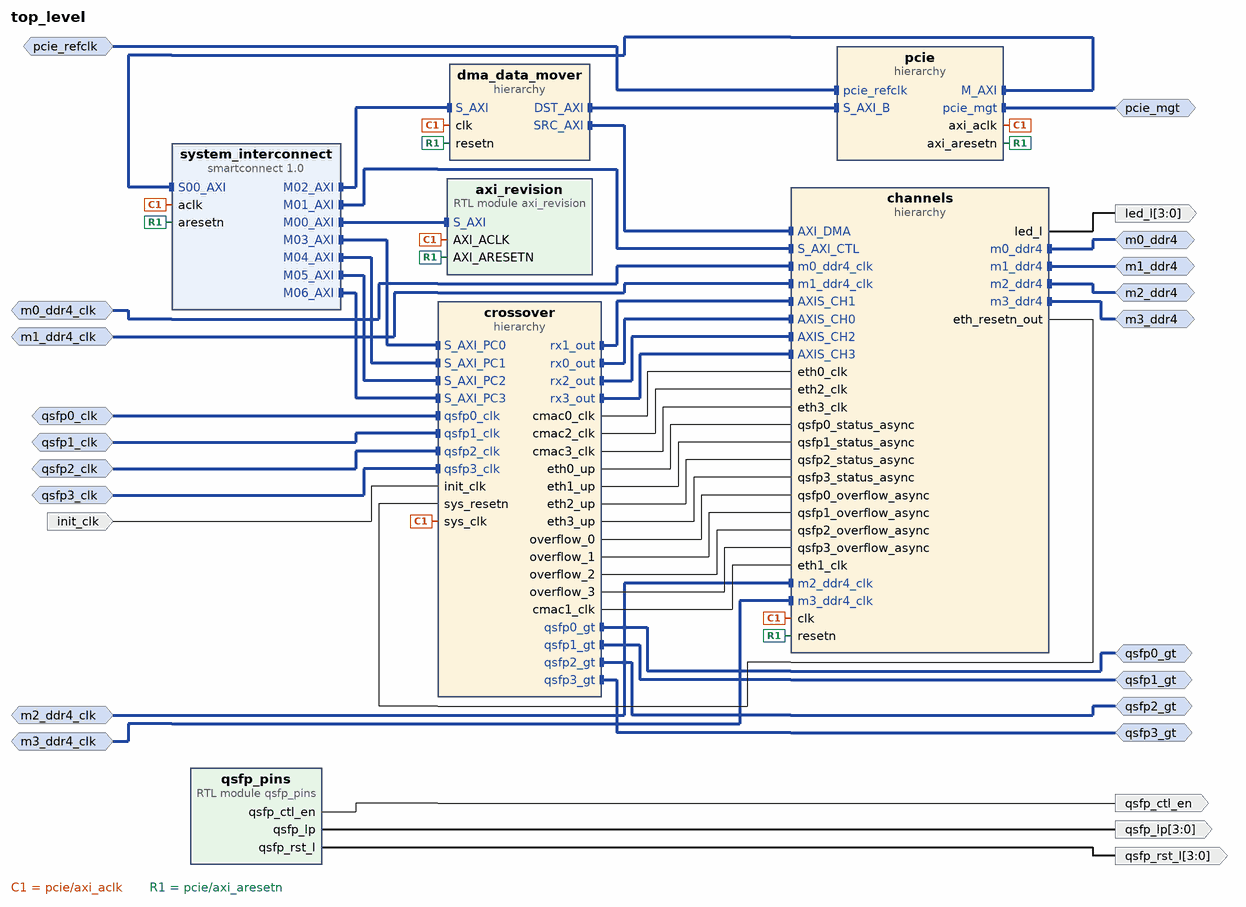
[diagram p0: block diagram of the top level]
# Vivado block design top_level, xcvu9p-flgb2104-3-e, Vivado 2021.1
create_bd_design top_level

create_bd_intf_port -mode Slave -vlnv xilinx.com:interface:diff_clock_rtl:1.0 qsfp0_clk
set_property -dict {CONFIG.FREQ_HZ 322265625} [get_bd_intf_ports qsfp0_clk]
create_bd_intf_port -mode Master -vlnv xilinx.com:interface:gt_rtl:1.0 qsfp0_gt
create_bd_intf_port -mode Master -vlnv xilinx.com:interface:gt_rtl:1.0 qsfp1_gt
create_bd_intf_port -mode Slave -vlnv xilinx.com:interface:diff_clock_rtl:1.0 qsfp1_clk
set_property -dict {CONFIG.FREQ_HZ 322265625} [get_bd_intf_ports qsfp1_clk]
create_bd_intf_port -mode Slave -vlnv xilinx.com:interface:diff_clock_rtl:1.0 pcie_refclk
create_bd_intf_port -mode Master -vlnv xilinx.com:interface:pcie_7x_mgt_rtl:1.0 pcie_mgt
create_bd_intf_port -mode Master -vlnv xilinx.com:interface:gt_rtl:1.0 qsfp2_gt
create_bd_intf_port -mode Slave -vlnv xilinx.com:interface:diff_clock_rtl:1.0 qsfp2_clk
set_property -dict {CONFIG.FREQ_HZ 322265625} [get_bd_intf_ports qsfp2_clk]
create_bd_intf_port -mode Master -vlnv xilinx.com:interface:gt_rtl:1.0 qsfp3_gt
create_bd_intf_port -mode Slave -vlnv xilinx.com:interface:diff_clock_rtl:1.0 qsfp3_clk
set_property -dict {CONFIG.FREQ_HZ 322265625} [get_bd_intf_ports qsfp3_clk]
create_bd_intf_port -mode Master -vlnv xilinx.com:interface:ddr4_rtl:1.0 m0_ddr4
create_bd_intf_port -mode Slave -vlnv xilinx.com:interface:diff_clock_rtl:1.0 m0_ddr4_clk
create_bd_intf_port -mode Master -vlnv xilinx.com:interface:ddr4_rtl:1.0 m1_ddr4
create_bd_intf_port -mode Slave -vlnv xilinx.com:interface:diff_clock_rtl:1.0 m1_ddr4_clk
create_bd_intf_port -mode Slave -vlnv xilinx.com:interface:diff_clock_rtl:1.0 m2_ddr4_clk
create_bd_intf_port -mode Master -vlnv xilinx.com:interface:ddr4_rtl:1.0 m2_ddr4
create_bd_intf_port -mode Master -vlnv xilinx.com:interface:ddr4_rtl:1.0 m3_ddr4
create_bd_intf_port -mode Slave -vlnv xilinx.com:interface:diff_clock_rtl:1.0 m3_ddr4_clk
create_bd_port -dir O -from 3 -to 0 qsfp_rst_l
create_bd_port -dir O -from 3 -to 0 qsfp_lp
create_bd_port -dir I init_clk
create_bd_port -dir O qsfp_ctl_en
create_bd_port -dir O -from 3 -to 0 led_l

create_bd_cell -type hier crossover
create_bd_cell -type hier pcie
create_bd_cell -type module -reference qsfp_pins qsfp_pins
create_bd_cell -type hier channels
create_bd_cell -type ip -vlnv xilinx.com:ip:smartconnect:1.0 system_interconnect
set_property -dict {CONFIG.NUM_MI 7 CONFIG.NUM_SI 1} [get_bd_cells system_interconnect]
create_bd_cell -type hier dma_data_mover
create_bd_cell -type module -reference axi_revision axi_revision
set_property -dict {CONFIG.S_AXI_ADDR_WIDTH 5} [get_bd_cells axi_revision]

# ---- hierarchy /crossover ----
current_bd_instance /crossover
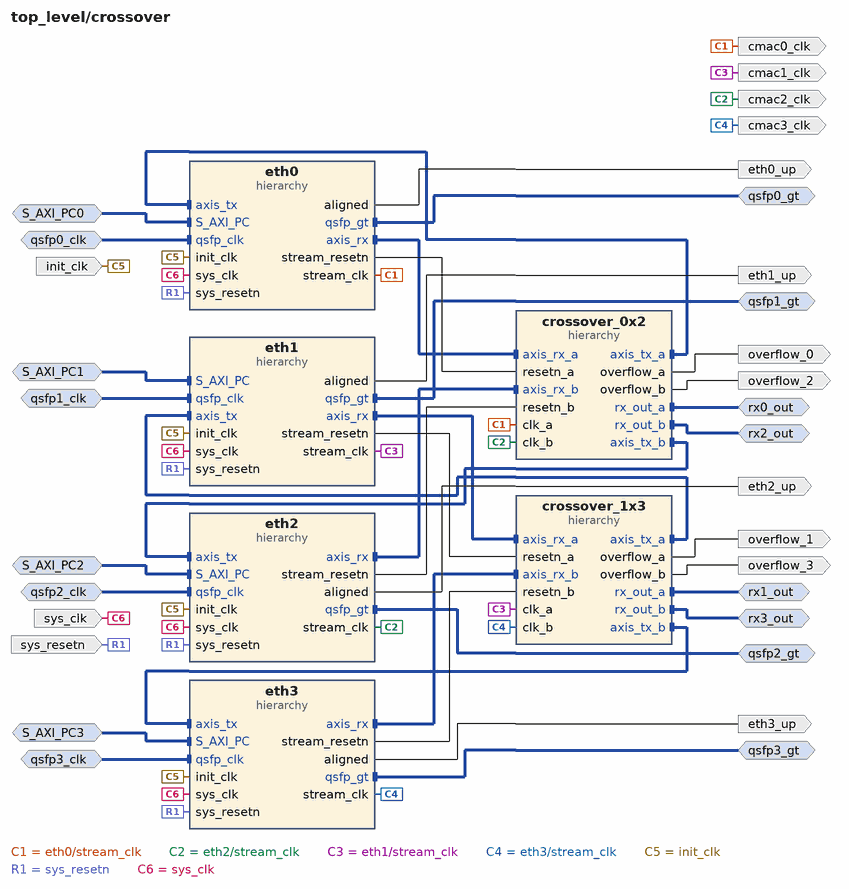
[diagram p1: block diagram inside /crossover]
create_bd_intf_pin -mode Master -vlnv xilinx.com:interface:gt_rtl:1.0 qsfp0_gt
create_bd_intf_pin -mode Slave -vlnv xilinx.com:interface:diff_clock_rtl:1.0 qsfp0_clk
create_bd_intf_pin -mode Master -vlnv xilinx.com:interface:gt_rtl:1.0 qsfp1_gt
create_bd_intf_pin -mode Slave -vlnv xilinx.com:interface:diff_clock_rtl:1.0 qsfp1_clk
create_bd_intf_pin -mode Master -vlnv xilinx.com:interface:gt_rtl:1.0 qsfp2_gt
create_bd_intf_pin -mode Slave -vlnv xilinx.com:interface:diff_clock_rtl:1.0 qsfp2_clk
create_bd_intf_pin -mode Master -vlnv xilinx.com:interface:gt_rtl:1.0 qsfp3_gt
create_bd_intf_pin -mode Slave -vlnv xilinx.com:interface:diff_clock_rtl:1.0 qsfp3_clk
create_bd_intf_pin -mode Master -vlnv xilinx.com:interface:axis_rtl:1.0 rx0_out
create_bd_intf_pin -mode Master -vlnv xilinx.com:interface:axis_rtl:1.0 rx2_out
create_bd_intf_pin -mode Master -vlnv xilinx.com:interface:axis_rtl:1.0 rx1_out
create_bd_intf_pin -mode Master -vlnv xilinx.com:interface:axis_rtl:1.0 rx3_out
create_bd_intf_pin -mode Slave -vlnv xilinx.com:interface:aximm_rtl:1.0 S_AXI_PC0
create_bd_intf_pin -mode Slave -vlnv xilinx.com:interface:aximm_rtl:1.0 S_AXI_PC2
create_bd_intf_pin -mode Slave -vlnv xilinx.com:interface:aximm_rtl:1.0 S_AXI_PC1
create_bd_intf_pin -mode Slave -vlnv xilinx.com:interface:aximm_rtl:1.0 S_AXI_PC3
create_bd_pin -dir I init_clk
create_bd_pin -dir I sys_resetn
create_bd_pin -dir O overflow_0
create_bd_pin -dir O overflow_2
create_bd_pin -dir O overflow_1
create_bd_pin -dir O overflow_3
create_bd_pin -dir O cmac2_clk
create_bd_pin -dir O cmac0_clk
create_bd_pin -dir O cmac1_clk
create_bd_pin -dir O cmac3_clk
create_bd_pin -dir O eth2_up
create_bd_pin -dir O eth1_up
create_bd_pin -dir O eth3_up
create_bd_pin -dir O eth0_up
create_bd_pin -dir I sys_clk

create_bd_cell -type hier crossover_0x2
create_bd_cell -type hier eth0
create_bd_cell -type hier eth2
create_bd_cell -type hier eth1
create_bd_cell -type hier eth3
create_bd_cell -type hier crossover_1x3

# ---- hierarchy /crossover/crossover_0x2 ----
current_bd_instance /crossover/crossover_0x2
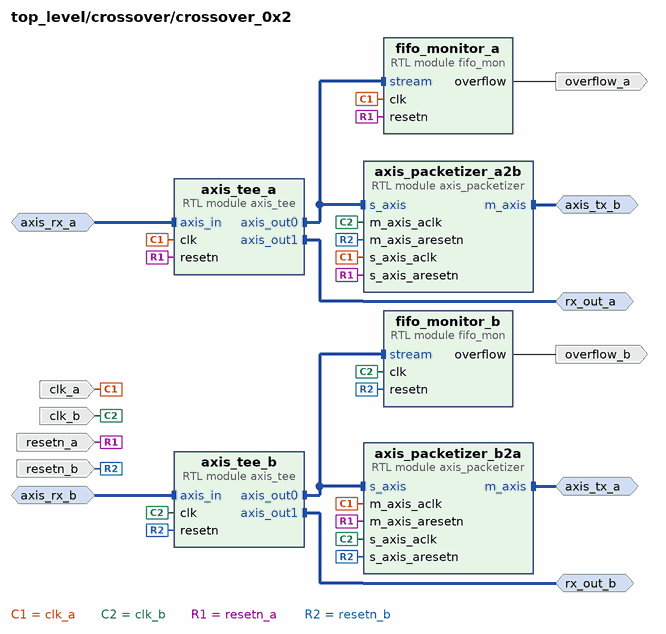
[diagram p2: block diagram inside /crossover/crossover_0x2]
create_bd_intf_pin -mode Slave -vlnv xilinx.com:interface:axis_rtl:1.0 axis_rx_a
create_bd_intf_pin -mode Master -vlnv xilinx.com:interface:axis_rtl:1.0 axis_tx_b
create_bd_intf_pin -mode Master -vlnv xilinx.com:interface:axis_rtl:1.0 axis_tx_a
create_bd_intf_pin -mode Slave -vlnv xilinx.com:interface:axis_rtl:1.0 axis_rx_b
create_bd_intf_pin -mode Master -vlnv xilinx.com:interface:axis_rtl:1.0 rx_out_a
create_bd_intf_pin -mode Master -vlnv xilinx.com:interface:axis_rtl:1.0 rx_out_b
create_bd_pin -dir I clk_a
create_bd_pin -dir I resetn_a
create_bd_pin -dir I clk_b
create_bd_pin -dir I resetn_b
create_bd_pin -dir O overflow_a
create_bd_pin -dir O overflow_b

create_bd_cell -type module -reference axis_tee axis_tee_a
create_bd_cell -type module -reference axis_tee axis_tee_b
create_bd_cell -type module -reference fifo_mon fifo_monitor_a
create_bd_cell -type module -reference fifo_mon fifo_monitor_b
create_bd_cell -type module -reference axis_packetizer axis_packetizer_a2b
create_bd_cell -type module -reference axis_packetizer axis_packetizer_b2a

# ---- hierarchy /crossover/eth0 ----
current_bd_instance /crossover/eth0
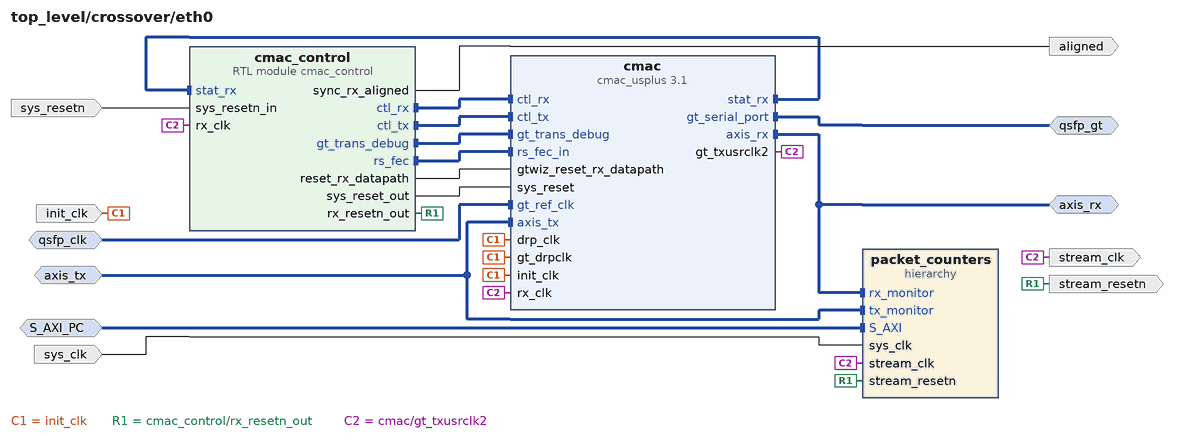
[diagram p3: block diagram inside /crossover/eth0]
create_bd_intf_pin -mode Master -vlnv xilinx.com:interface:gt_rtl:1.0 qsfp_gt
create_bd_intf_pin -mode Slave -vlnv xilinx.com:interface:diff_clock_rtl:1.0 qsfp_clk
create_bd_intf_pin -mode Slave -vlnv xilinx.com:interface:axis_rtl:1.0 axis_tx
create_bd_intf_pin -mode Master -vlnv xilinx.com:interface:axis_rtl:1.0 axis_rx
create_bd_intf_pin -mode Slave -vlnv xilinx.com:interface:aximm_rtl:1.0 S_AXI_PC
create_bd_pin -dir I -type rst sys_resetn
create_bd_pin -dir O -type clk stream_clk
create_bd_pin -dir O -type rst stream_resetn
create_bd_pin -dir O aligned
create_bd_pin -dir I init_clk
create_bd_pin -dir I sys_clk

create_bd_cell -type ip -vlnv xilinx.com:ip:cmac_usplus:3.1 cmac
set_property -dict [list \
  CONFIG.ADD_GT_CNRL_STS_PORTS 1 \
  CONFIG.CMAC_CAUI4_MODE 1 \
  CONFIG.CMAC_CORE_SELECT CMACE4_X0Y1 \
  CONFIG.GT_DRP_CLK 50 \
  CONFIG.GT_GROUP_SELECT {X0Y4~X0Y7} \
  CONFIG.GT_REF_CLK_FREQ 322.265625 \
  CONFIG.INCLUDE_RS_FEC 1 \
  CONFIG.NUM_LANES 4x25 \
  CONFIG.RX_FLOW_CONTROL 0 \
  CONFIG.RX_GT_BUFFER 1 \
  CONFIG.TX_FLOW_CONTROL 0 \
  CONFIG.USER_INTERFACE AXIS \
] [get_bd_cells cmac]
create_bd_cell -type module -reference cmac_control cmac_control
set_property -dict {CONFIG.USE_SYS_RESET_OUT 1} [get_bd_cells cmac_control]
create_bd_cell -type hier packet_counters

# ---- hierarchy /crossover/eth0/packet_counters ----
current_bd_instance /crossover/eth0/packet_counters
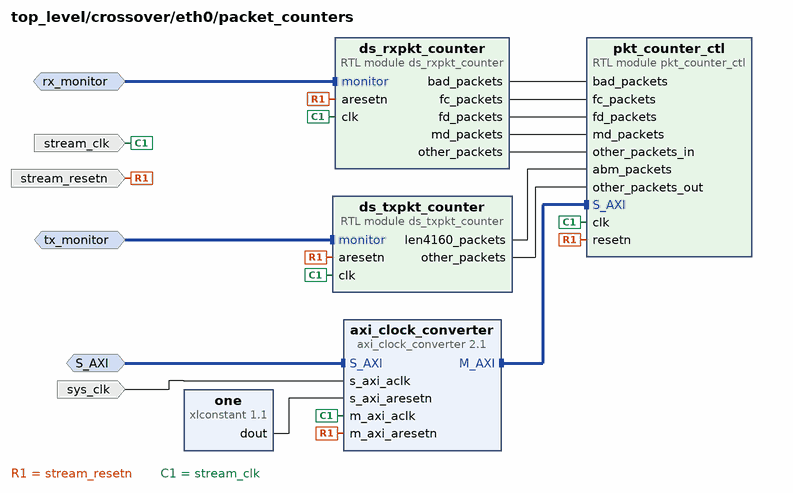
[diagram p4: block diagram inside /crossover/eth0/packet_counters]
create_bd_intf_pin -mode Monitor -vlnv xilinx.com:interface:axis_rtl:1.0 tx_monitor
create_bd_intf_pin -mode Monitor -vlnv xilinx.com:interface:axis_rtl:1.0 rx_monitor
create_bd_intf_pin -mode Slave -vlnv xilinx.com:interface:aximm_rtl:1.0 S_AXI
create_bd_pin -dir I -type clk stream_clk
create_bd_pin -dir I -type rst stream_resetn
create_bd_pin -dir I sys_clk

create_bd_cell -type ip -vlnv xilinx.com:ip:axi_clock_converter:2.1 axi_clock_converter
create_bd_cell -type ip -vlnv xilinx.com:ip:xlconstant:1.1 one
create_bd_cell -type module -reference pkt_counter_ctl pkt_counter_ctl
create_bd_cell -type module -reference ds_rxpkt_counter ds_rxpkt_counter
create_bd_cell -type module -reference ds_txpkt_counter ds_txpkt_counter

# ---- hierarchy /crossover/eth2 ----
current_bd_instance /crossover/eth2
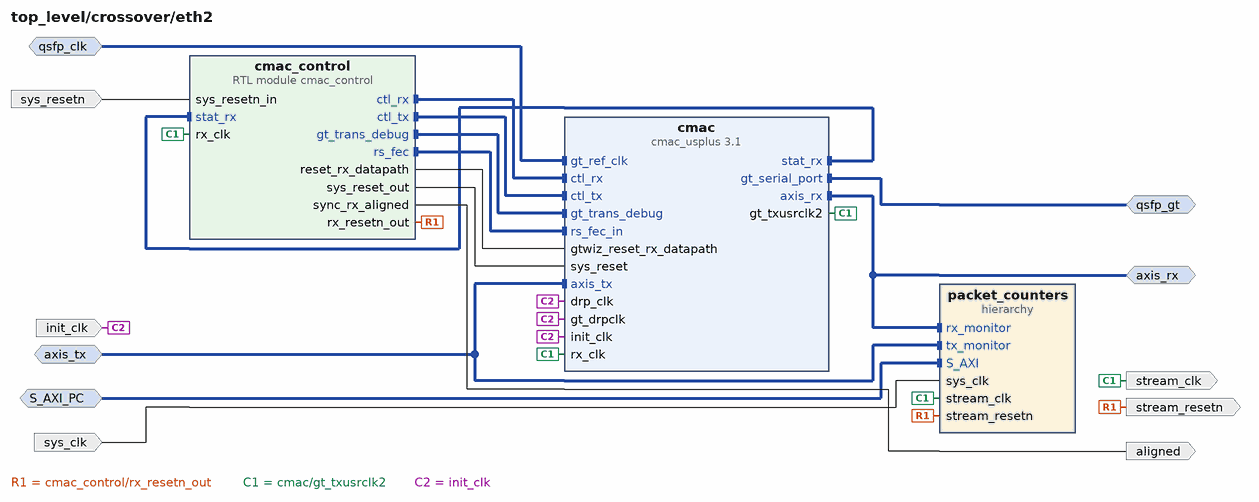
[diagram p5: block diagram inside /crossover/eth2]
create_bd_intf_pin -mode Master -vlnv xilinx.com:interface:gt_rtl:1.0 qsfp_gt
create_bd_intf_pin -mode Slave -vlnv xilinx.com:interface:axis_rtl:1.0 axis_tx
create_bd_intf_pin -mode Master -vlnv xilinx.com:interface:axis_rtl:1.0 axis_rx
create_bd_intf_pin -mode Slave -vlnv xilinx.com:interface:diff_clock_rtl:1.0 qsfp_clk
create_bd_intf_pin -mode Slave -vlnv xilinx.com:interface:aximm_rtl:1.0 S_AXI_PC
create_bd_pin -dir I -type rst sys_resetn
create_bd_pin -dir O -type clk stream_clk
create_bd_pin -dir O -type rst stream_resetn
create_bd_pin -dir O aligned
create_bd_pin -dir I init_clk
create_bd_pin -dir I sys_clk

create_bd_cell -type ip -vlnv xilinx.com:ip:cmac_usplus:3.1 cmac
set_property -dict [list \
  CONFIG.ADD_GT_CNRL_STS_PORTS 1 \
  CONFIG.CMAC_CAUI4_MODE 1 \
  CONFIG.CMAC_CORE_SELECT CMACE4_X0Y4 \
  CONFIG.GT_DRP_CLK 50 \
  CONFIG.GT_GROUP_SELECT {X0Y24~X0Y27} \
  CONFIG.GT_REF_CLK_FREQ 322.265625 \
  CONFIG.INCLUDE_RS_FEC 1 \
  CONFIG.NUM_LANES 4x25 \
  CONFIG.RX_FLOW_CONTROL 0 \
  CONFIG.RX_GT_BUFFER 1 \
  CONFIG.TX_FLOW_CONTROL 0 \
  CONFIG.USER_INTERFACE AXIS \
] [get_bd_cells cmac]
create_bd_cell -type module -reference cmac_control cmac_control
set_property -dict {CONFIG.USE_SYS_RESET_OUT 1} [get_bd_cells cmac_control]
create_bd_cell -type hier packet_counters

# ---- hierarchy /crossover/eth2/packet_counters ----
current_bd_instance /crossover/eth2/packet_counters
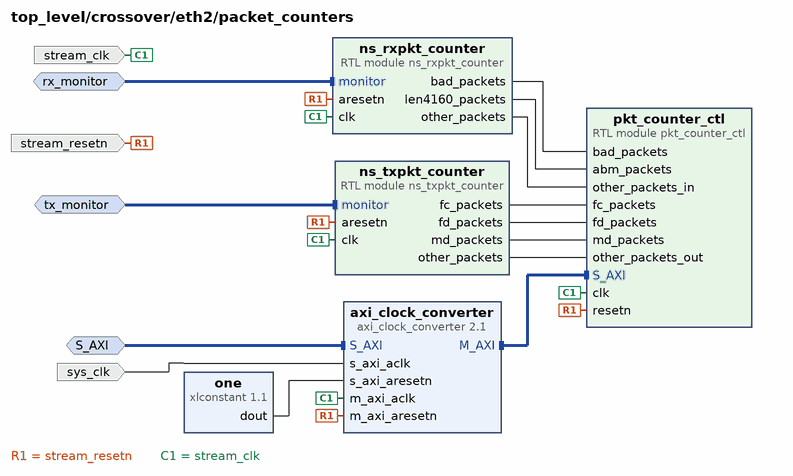
[diagram p6: block diagram inside /crossover/eth2/packet_counters]
create_bd_intf_pin -mode Monitor -vlnv xilinx.com:interface:axis_rtl:1.0 tx_monitor
create_bd_intf_pin -mode Monitor -vlnv xilinx.com:interface:axis_rtl:1.0 rx_monitor
create_bd_intf_pin -mode Slave -vlnv xilinx.com:interface:aximm_rtl:1.0 S_AXI
create_bd_pin -dir I -type clk stream_clk
create_bd_pin -dir I -type rst stream_resetn
create_bd_pin -dir I sys_clk

create_bd_cell -type module -reference ns_txpkt_counter ns_txpkt_counter
create_bd_cell -type module -reference ns_rxpkt_counter ns_rxpkt_counter
create_bd_cell -type ip -vlnv xilinx.com:ip:axi_clock_converter:2.1 axi_clock_converter
create_bd_cell -type ip -vlnv xilinx.com:ip:xlconstant:1.1 one
create_bd_cell -type module -reference pkt_counter_ctl pkt_counter_ctl

# ---- hierarchy /crossover/eth1 ----
current_bd_instance /crossover/eth1
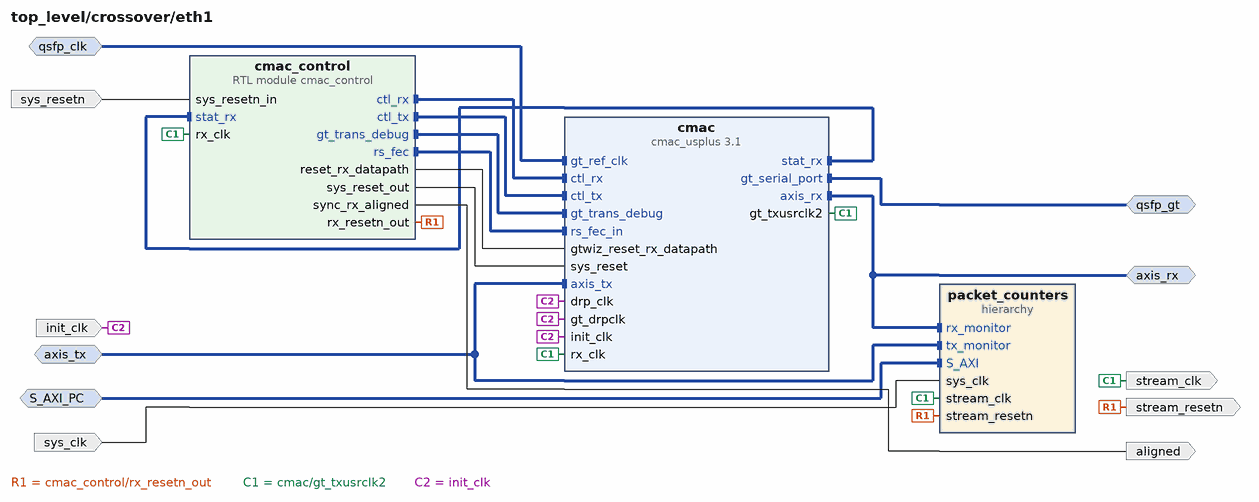
[diagram p7: block diagram inside /crossover/eth1]
create_bd_intf_pin -mode Master -vlnv xilinx.com:interface:gt_rtl:1.0 qsfp_gt
create_bd_intf_pin -mode Slave -vlnv xilinx.com:interface:axis_rtl:1.0 axis_tx
create_bd_intf_pin -mode Master -vlnv xilinx.com:interface:axis_rtl:1.0 axis_rx
create_bd_intf_pin -mode Slave -vlnv xilinx.com:interface:diff_clock_rtl:1.0 qsfp_clk
create_bd_intf_pin -mode Slave -vlnv xilinx.com:interface:aximm_rtl:1.0 S_AXI_PC
create_bd_pin -dir I -type rst sys_resetn
create_bd_pin -dir O -type clk stream_clk
create_bd_pin -dir O -type rst stream_resetn
create_bd_pin -dir O aligned
create_bd_pin -dir I init_clk
create_bd_pin -dir I sys_clk

create_bd_cell -type ip -vlnv xilinx.com:ip:cmac_usplus:3.1 cmac
set_property -dict [list \
  CONFIG.ADD_GT_CNRL_STS_PORTS 1 \
  CONFIG.CMAC_CAUI4_MODE 1 \
  CONFIG.CMAC_CORE_SELECT CMACE4_X0Y2 \
  CONFIG.GT_DRP_CLK 50 \
  CONFIG.GT_GROUP_SELECT {X0Y12~X0Y15} \
  CONFIG.GT_REF_CLK_FREQ 322.265625 \
  CONFIG.INCLUDE_RS_FEC 1 \
  CONFIG.NUM_LANES 4x25 \
  CONFIG.RX_FLOW_CONTROL 0 \
  CONFIG.RX_GT_BUFFER 1 \
  CONFIG.TX_FLOW_CONTROL 0 \
  CONFIG.USER_INTERFACE AXIS \
] [get_bd_cells cmac]
create_bd_cell -type module -reference cmac_control cmac_control
set_property -dict {CONFIG.USE_SYS_RESET_OUT 1} [get_bd_cells cmac_control]
create_bd_cell -type hier packet_counters

# ---- hierarchy /crossover/eth1/packet_counters ----
current_bd_instance /crossover/eth1/packet_counters
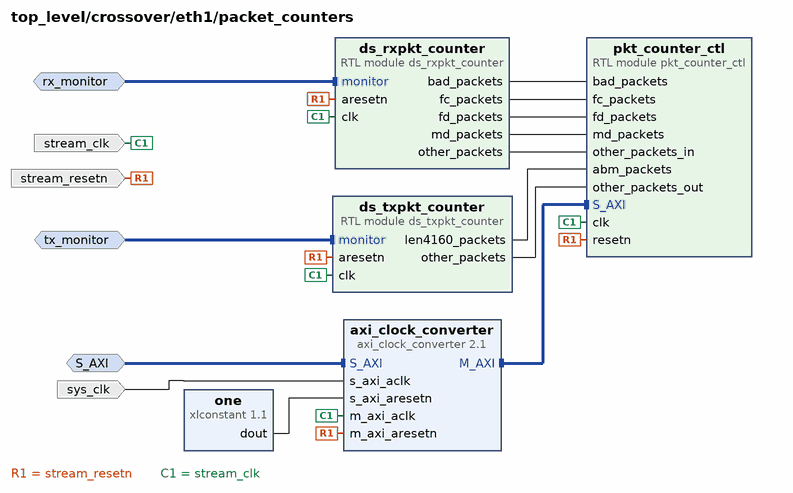
[diagram p8: block diagram inside /crossover/eth1/packet_counters]
create_bd_intf_pin -mode Monitor -vlnv xilinx.com:interface:axis_rtl:1.0 tx_monitor
create_bd_intf_pin -mode Monitor -vlnv xilinx.com:interface:axis_rtl:1.0 rx_monitor
create_bd_intf_pin -mode Slave -vlnv xilinx.com:interface:aximm_rtl:1.0 S_AXI
create_bd_pin -dir I -type clk stream_clk
create_bd_pin -dir I -type rst stream_resetn
create_bd_pin -dir I sys_clk

create_bd_cell -type ip -vlnv xilinx.com:ip:axi_clock_converter:2.1 axi_clock_converter
create_bd_cell -type ip -vlnv xilinx.com:ip:xlconstant:1.1 one
create_bd_cell -type module -reference pkt_counter_ctl pkt_counter_ctl
create_bd_cell -type module -reference ds_rxpkt_counter ds_rxpkt_counter
create_bd_cell -type module -reference ds_txpkt_counter ds_txpkt_counter

# ---- hierarchy /crossover/eth3 ----
current_bd_instance /crossover/eth3
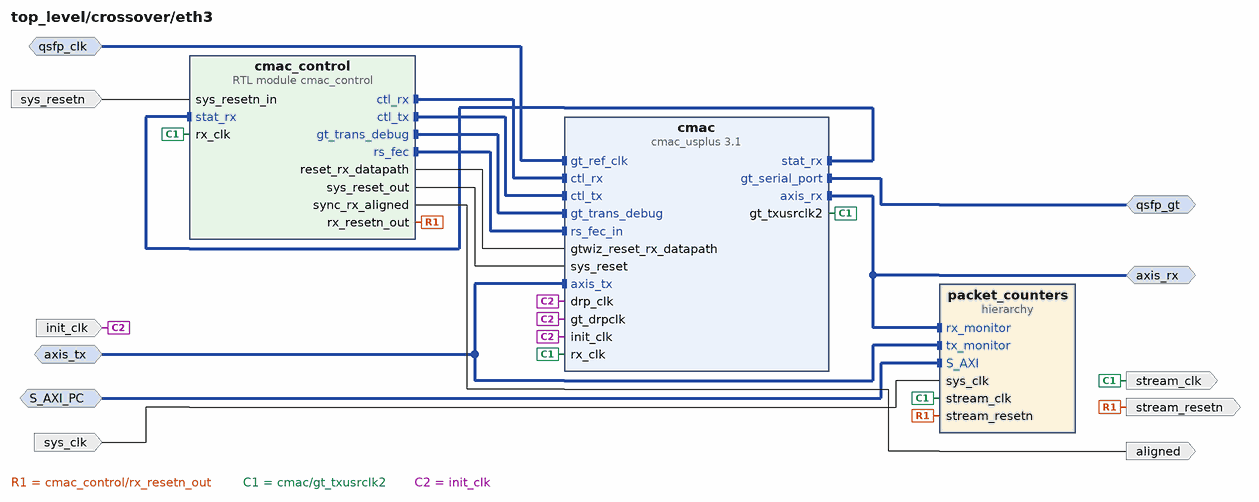
[diagram p9: block diagram inside /crossover/eth3]
create_bd_intf_pin -mode Master -vlnv xilinx.com:interface:gt_rtl:1.0 qsfp_gt
create_bd_intf_pin -mode Slave -vlnv xilinx.com:interface:axis_rtl:1.0 axis_tx
create_bd_intf_pin -mode Master -vlnv xilinx.com:interface:axis_rtl:1.0 axis_rx
create_bd_intf_pin -mode Slave -vlnv xilinx.com:interface:diff_clock_rtl:1.0 qsfp_clk
create_bd_intf_pin -mode Slave -vlnv xilinx.com:interface:aximm_rtl:1.0 S_AXI_PC
create_bd_pin -dir I -type rst sys_resetn
create_bd_pin -dir O -type clk stream_clk
create_bd_pin -dir O -type rst stream_resetn
create_bd_pin -dir O aligned
create_bd_pin -dir I init_clk
create_bd_pin -dir I sys_clk

create_bd_cell -type ip -vlnv xilinx.com:ip:cmac_usplus:3.1 cmac
set_property -dict [list \
  CONFIG.ADD_GT_CNRL_STS_PORTS 1 \
  CONFIG.CMAC_CAUI4_MODE 1 \
  CONFIG.CMAC_CORE_SELECT CMACE4_X0Y5 \
  CONFIG.GT_DRP_CLK 50 \
  CONFIG.GT_GROUP_SELECT {X0Y32~X0Y35} \
  CONFIG.GT_REF_CLK_FREQ 322.265625 \
  CONFIG.INCLUDE_RS_FEC 1 \
  CONFIG.NUM_LANES 4x25 \
  CONFIG.RX_FLOW_CONTROL 0 \
  CONFIG.RX_GT_BUFFER 1 \
  CONFIG.TX_FLOW_CONTROL 0 \
  CONFIG.USER_INTERFACE AXIS \
] [get_bd_cells cmac]
create_bd_cell -type module -reference cmac_control cmac_control
set_property -dict {CONFIG.USE_SYS_RESET_OUT 1} [get_bd_cells cmac_control]
create_bd_cell -type hier packet_counters

# ---- hierarchy /crossover/eth3/packet_counters ----
current_bd_instance /crossover/eth3/packet_counters
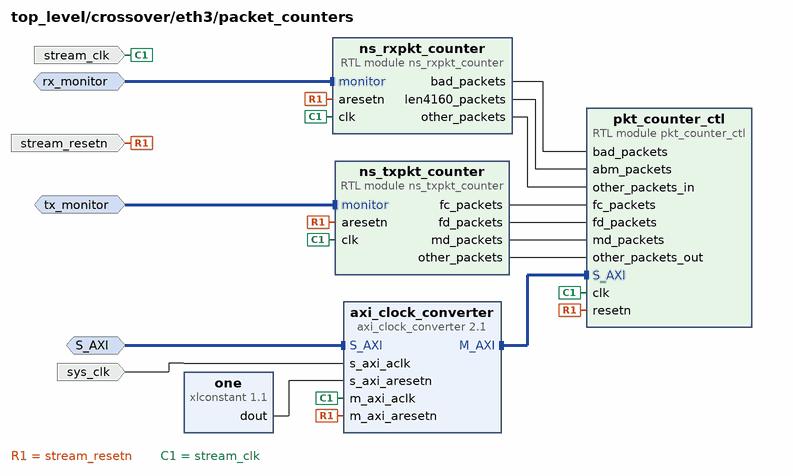
[diagram p10: block diagram inside /crossover/eth3/packet_counters]
create_bd_intf_pin -mode Monitor -vlnv xilinx.com:interface:axis_rtl:1.0 tx_monitor
create_bd_intf_pin -mode Monitor -vlnv xilinx.com:interface:axis_rtl:1.0 rx_monitor
create_bd_intf_pin -mode Slave -vlnv xilinx.com:interface:aximm_rtl:1.0 S_AXI
create_bd_pin -dir I -type clk stream_clk
create_bd_pin -dir I -type rst stream_resetn
create_bd_pin -dir I sys_clk

create_bd_cell -type module -reference ns_txpkt_counter ns_txpkt_counter
create_bd_cell -type module -reference ns_rxpkt_counter ns_rxpkt_counter
create_bd_cell -type ip -vlnv xilinx.com:ip:axi_clock_converter:2.1 axi_clock_converter
create_bd_cell -type ip -vlnv xilinx.com:ip:xlconstant:1.1 one
create_bd_cell -type module -reference pkt_counter_ctl pkt_counter_ctl

# ---- hierarchy /crossover/crossover_1x3 ----
current_bd_instance /crossover/crossover_1x3
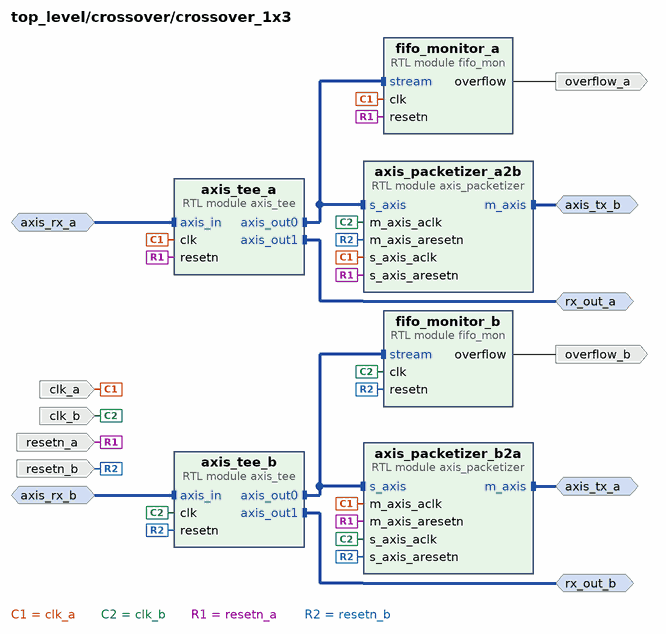
[diagram p11: block diagram inside /crossover/crossover_1x3]
create_bd_intf_pin -mode Slave -vlnv xilinx.com:interface:axis_rtl:1.0 axis_rx_a
create_bd_intf_pin -mode Master -vlnv xilinx.com:interface:axis_rtl:1.0 axis_tx_b
create_bd_intf_pin -mode Master -vlnv xilinx.com:interface:axis_rtl:1.0 axis_tx_a
create_bd_intf_pin -mode Slave -vlnv xilinx.com:interface:axis_rtl:1.0 axis_rx_b
create_bd_intf_pin -mode Master -vlnv xilinx.com:interface:axis_rtl:1.0 rx_out_a
create_bd_intf_pin -mode Master -vlnv xilinx.com:interface:axis_rtl:1.0 rx_out_b
create_bd_pin -dir I clk_a
create_bd_pin -dir I clk_b
create_bd_pin -dir O overflow_a
create_bd_pin -dir I resetn_a
create_bd_pin -dir I resetn_b
create_bd_pin -dir O overflow_b

create_bd_cell -type module -reference axis_tee axis_tee_a
create_bd_cell -type module -reference axis_tee axis_tee_b
create_bd_cell -type module -reference fifo_mon fifo_monitor_a
create_bd_cell -type module -reference fifo_mon fifo_monitor_b
create_bd_cell -type module -reference axis_packetizer axis_packetizer_a2b
create_bd_cell -type module -reference axis_packetizer axis_packetizer_b2a

# ---- hierarchy /pcie ----
current_bd_instance /pcie
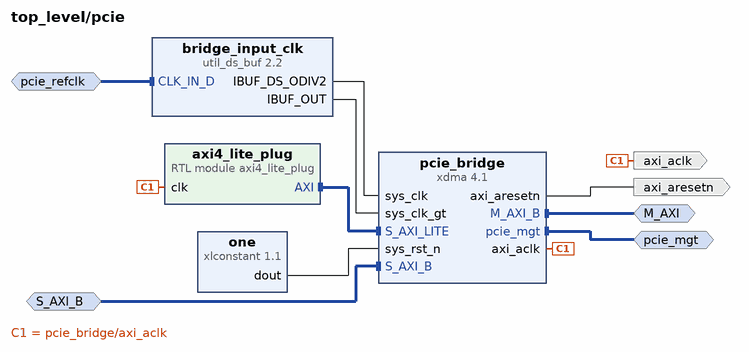
[diagram p12: block diagram inside /pcie]
create_bd_intf_pin -mode Master -vlnv xilinx.com:interface:pcie_7x_mgt_rtl:1.0 pcie_mgt
create_bd_intf_pin -mode Slave -vlnv xilinx.com:interface:diff_clock_rtl:1.0 pcie_refclk
create_bd_intf_pin -mode Master -vlnv xilinx.com:interface:aximm_rtl:1.0 M_AXI
create_bd_intf_pin -mode Slave -vlnv xilinx.com:interface:aximm_rtl:1.0 S_AXI_B
create_bd_pin -dir O -type clk axi_aclk
create_bd_pin -dir O -type rst axi_aresetn

create_bd_cell -type ip -vlnv xilinx.com:ip:util_ds_buf:2.2 bridge_input_clk
set_property -dict {CONFIG.C_BUF_TYPE IBUFDSGTE} [get_bd_cells bridge_input_clk]
create_bd_cell -type ip -vlnv xilinx.com:ip:xdma:4.1 pcie_bridge
set_property -dict [list \
  CONFIG.PF0_DEVICE_ID_mqdma 903F \
  CONFIG.PF0_SRIOV_VF_DEVICE_ID A03F \
  CONFIG.PF2_DEVICE_ID_mqdma 923F \
  CONFIG.PF3_DEVICE_ID_mqdma 933F \
  CONFIG.axi_addr_width 64 \
  CONFIG.axi_data_width 512_bit \
  CONFIG.axisten_freq 250 \
  CONFIG.bridge_burst true \
  CONFIG.en_axi_master_if true \
  CONFIG.en_axi_slave_if true \
  CONFIG.functional_mode AXI_Bridge \
  CONFIG.mode_selection Advanced \
  CONFIG.pcie_blk_locn X1Y2 \
  CONFIG.pciebar2axibar_1 0x0000001000000000 \
  CONFIG.pf0_bar0_scale Megabytes \
  CONFIG.pf0_bar0_size 1 \
  CONFIG.pf0_bar1_enabled true \
  CONFIG.pf0_bar1_scale Megabytes \
  CONFIG.pf0_bar1_size 1 \
  CONFIG.pf0_device_id 903F \
  CONFIG.pl_link_cap_max_link_speed 8.0_GT/s \
  CONFIG.pl_link_cap_max_link_width X16 \
  CONFIG.plltype QPLL1 \
] [get_bd_cells pcie_bridge]
create_bd_cell -type ip -vlnv xilinx.com:ip:xlconstant:1.1 one
create_bd_cell -type module -reference axi4_lite_plug axi4_lite_plug

# ---- hierarchy /channels ----
current_bd_instance /channels
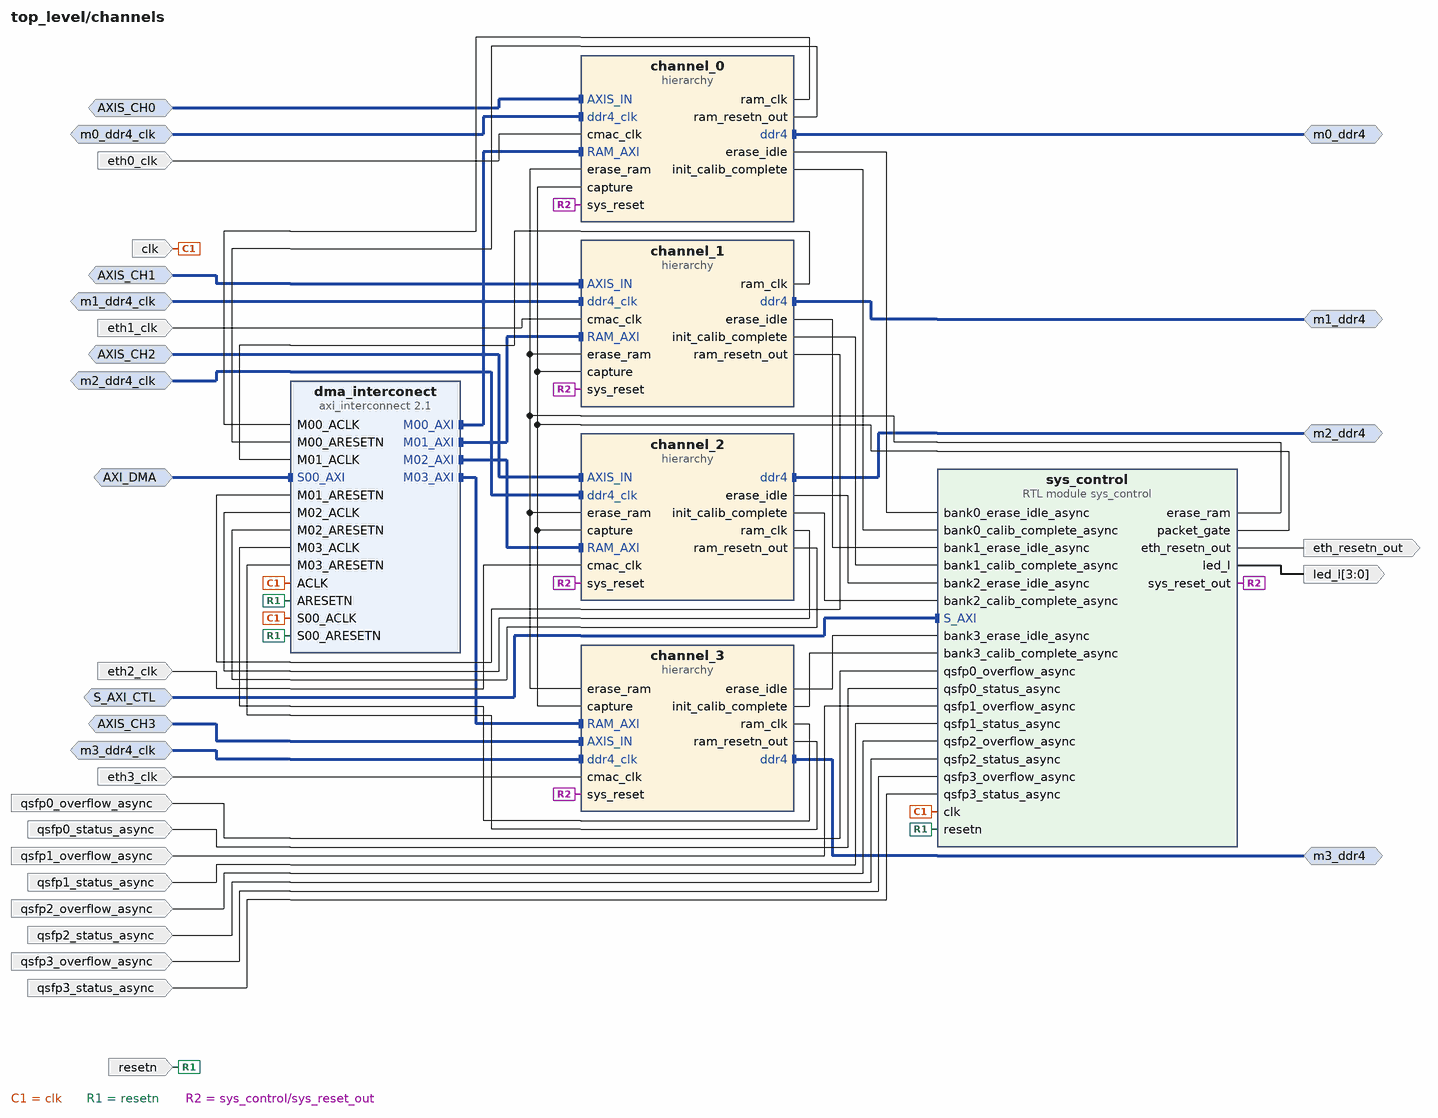
[diagram p13: block diagram inside /channels]
create_bd_intf_pin -mode Slave -vlnv xilinx.com:interface:aximm_rtl:1.0 S_AXI_CTL
create_bd_intf_pin -mode Slave -vlnv xilinx.com:interface:axis_rtl:1.0 AXIS_CH0
create_bd_intf_pin -mode Master -vlnv xilinx.com:interface:ddr4_rtl:1.0 m0_ddr4
create_bd_intf_pin -mode Slave -vlnv xilinx.com:interface:diff_clock_rtl:1.0 m0_ddr4_clk
create_bd_intf_pin -mode Slave -vlnv xilinx.com:interface:aximm_rtl:1.0 AXI_DMA
create_bd_intf_pin -mode Slave -vlnv xilinx.com:interface:axis_rtl:1.0 AXIS_CH1
create_bd_intf_pin -mode Slave -vlnv xilinx.com:interface:diff_clock_rtl:1.0 m1_ddr4_clk
create_bd_intf_pin -mode Master -vlnv xilinx.com:interface:ddr4_rtl:1.0 m1_ddr4
create_bd_intf_pin -mode Slave -vlnv xilinx.com:interface:diff_clock_rtl:1.0 m2_ddr4_clk
create_bd_intf_pin -mode Master -vlnv xilinx.com:interface:ddr4_rtl:1.0 m2_ddr4
create_bd_intf_pin -mode Slave -vlnv xilinx.com:interface:axis_rtl:1.0 AXIS_CH2
create_bd_intf_pin -mode Slave -vlnv xilinx.com:interface:axis_rtl:1.0 AXIS_CH3
create_bd_intf_pin -mode Master -vlnv xilinx.com:interface:ddr4_rtl:1.0 m3_ddr4
create_bd_intf_pin -mode Slave -vlnv xilinx.com:interface:diff_clock_rtl:1.0 m3_ddr4_clk
create_bd_pin -dir I -type clk clk
create_bd_pin -dir I -type rst resetn
create_bd_pin -dir O eth_resetn_out
create_bd_pin -dir O -from 3 -to 0 led_l
create_bd_pin -dir I eth0_clk
create_bd_pin -dir I qsfp0_status_async
create_bd_pin -dir I qsfp1_status_async
create_bd_pin -dir I qsfp2_status_async
create_bd_pin -dir I qsfp3_status_async
create_bd_pin -dir I eth1_clk
create_bd_pin -dir I eth2_clk
create_bd_pin -dir I eth3_clk
create_bd_pin -dir I qsfp0_overflow_async
create_bd_pin -dir I qsfp1_overflow_async
create_bd_pin -dir I qsfp2_overflow_async
create_bd_pin -dir I qsfp3_overflow_async

create_bd_cell -type hier channel_0
create_bd_cell -type ip -vlnv xilinx.com:ip:axi_interconnect:2.1 dma_interconect
set_property -dict {CONFIG.NUM_MI 4 CONFIG.NUM_SI 1 CONFIG.STRATEGY 1} [get_bd_cells dma_interconect]
create_bd_cell -type hier channel_1
create_bd_cell -type hier channel_2
create_bd_cell -type hier channel_3
create_bd_cell -type module -reference sys_control sys_control

# ---- hierarchy /channels/channel_0 ----
current_bd_instance /channels/channel_0
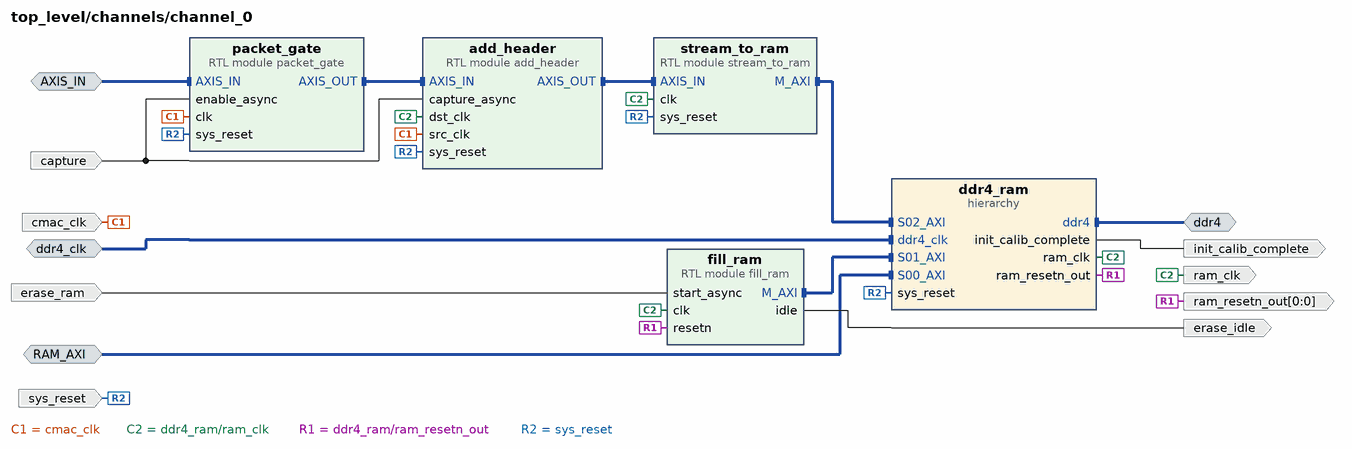
[diagram p14: block diagram inside /channels/channel_0]
create_bd_intf_pin -mode Slave -vlnv xilinx.com:interface:axis_rtl:1.0 AXIS_IN
create_bd_intf_pin -mode Master -vlnv xilinx.com:interface:ddr4_rtl:1.0 ddr4
create_bd_intf_pin -mode Slave -vlnv xilinx.com:interface:diff_clock_rtl:1.0 ddr4_clk
create_bd_intf_pin -mode Slave -vlnv xilinx.com:interface:aximm_rtl:1.0 RAM_AXI
create_bd_pin -dir I cmac_clk
create_bd_pin -dir I sys_reset
create_bd_pin -dir I capture
create_bd_pin -dir O erase_idle
create_bd_pin -dir I erase_ram
create_bd_pin -dir O init_calib_complete
create_bd_pin -dir O ram_clk
create_bd_pin -dir O -from 0 -to 0 ram_resetn_out

create_bd_cell -type module -reference packet_gate packet_gate
create_bd_cell -type hier ddr4_ram
create_bd_cell -type module -reference add_header add_header
create_bd_cell -type module -reference stream_to_ram stream_to_ram
create_bd_cell -type module -reference fill_ram fill_ram

# ---- hierarchy /channels/channel_0/ddr4_ram ----
current_bd_instance /channels/channel_0/ddr4_ram
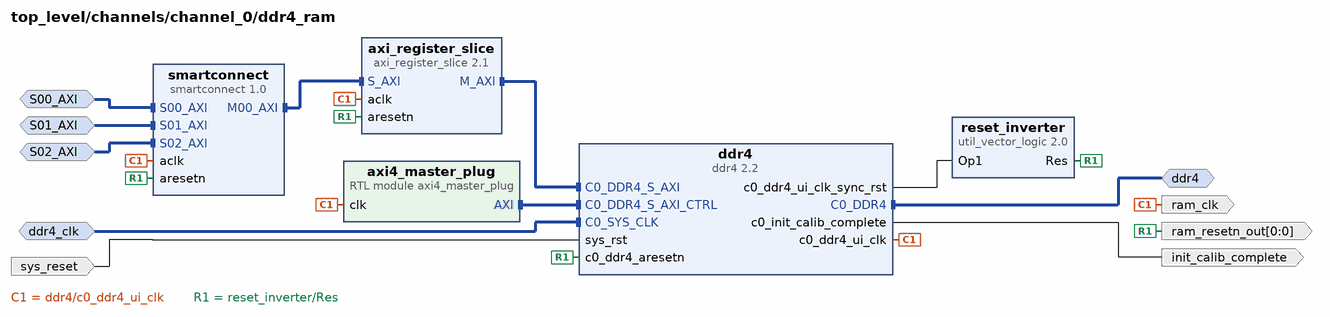
[diagram p15: block diagram inside /channels/channel_0/ddr4_ram]
create_bd_intf_pin -mode Slave -vlnv xilinx.com:interface:diff_clock_rtl:1.0 ddr4_clk
create_bd_intf_pin -mode Master -vlnv xilinx.com:interface:ddr4_rtl:1.0 ddr4
create_bd_intf_pin -mode Slave -vlnv xilinx.com:interface:aximm_rtl:1.0 S02_AXI
create_bd_intf_pin -mode Slave -vlnv xilinx.com:interface:aximm_rtl:1.0 S00_AXI
create_bd_intf_pin -mode Slave -vlnv xilinx.com:interface:aximm_rtl:1.0 S01_AXI
create_bd_pin -dir O -type clk ram_clk
create_bd_pin -dir I sys_reset
create_bd_pin -dir O init_calib_complete
create_bd_pin -dir O -from 0 -to 0 ram_resetn_out

create_bd_cell -type ip -vlnv xilinx.com:ip:ddr4:2.2 ddr4
set_property -dict [list \
  CONFIG.C0.DDR4_AxiAddressWidth 34 \
  CONFIG.C0.DDR4_AxiDataWidth 512 \
  CONFIG.C0.DDR4_CasWriteLatency 16 \
  CONFIG.C0.DDR4_CustomParts ../../../../../../ddr/MTA18ADF2G72PZ-2G3.csv \
  CONFIG.C0.DDR4_DataWidth 72 \
  CONFIG.C0.DDR4_EN_PARITY true \
  CONFIG.C0.DDR4_InputClockPeriod 9996 \
  CONFIG.C0.DDR4_MemoryPart MTA18ADF2G72PZ-2G3 \
  CONFIG.C0.DDR4_MemoryType RDIMMs \
  CONFIG.C0.DDR4_TimePeriod 833 \
  CONFIG.C0.DDR4_isCustom true \
] [get_bd_cells ddr4]
create_bd_cell -type ip -vlnv xilinx.com:ip:util_vector_logic:2.0 reset_inverter
set_property -dict {CONFIG.C_OPERATION not CONFIG.C_SIZE 1} [get_bd_cells reset_inverter]
create_bd_cell -type module -reference axi4_master_plug axi4_master_plug
create_bd_cell -type ip -vlnv xilinx.com:ip:smartconnect:1.0 smartconnect
set_property -dict {CONFIG.NUM_SI 3} [get_bd_cells smartconnect]
create_bd_cell -type ip -vlnv xilinx.com:ip:axi_register_slice:2.1 axi_register_slice
set_property -dict {CONFIG.REG_AR 1 CONFIG.REG_AW 1 CONFIG.REG_B 1} [get_bd_cells axi_register_slice]

# ---- hierarchy /channels/channel_1 ----
current_bd_instance /channels/channel_1
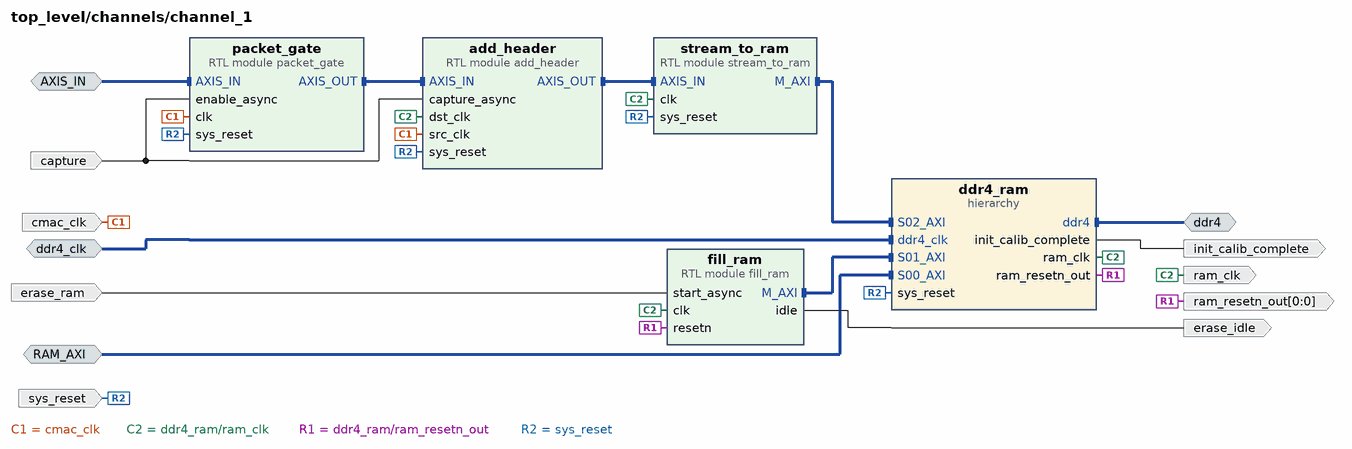
[diagram p16: block diagram inside /channels/channel_1]
create_bd_intf_pin -mode Slave -vlnv xilinx.com:interface:axis_rtl:1.0 AXIS_IN
create_bd_intf_pin -mode Master -vlnv xilinx.com:interface:ddr4_rtl:1.0 ddr4
create_bd_intf_pin -mode Slave -vlnv xilinx.com:interface:diff_clock_rtl:1.0 ddr4_clk
create_bd_intf_pin -mode Slave -vlnv xilinx.com:interface:aximm_rtl:1.0 RAM_AXI
create_bd_pin -dir I cmac_clk
create_bd_pin -dir I sys_reset
create_bd_pin -dir I capture
create_bd_pin -dir O erase_idle
create_bd_pin -dir I erase_ram
create_bd_pin -dir O init_calib_complete
create_bd_pin -dir O ram_clk
create_bd_pin -dir O -from 0 -to 0 ram_resetn_out

create_bd_cell -type module -reference packet_gate packet_gate
create_bd_cell -type hier ddr4_ram
create_bd_cell -type module -reference add_header add_header
set_property -dict {CONFIG.CHANNEL 1} [get_bd_cells add_header]
create_bd_cell -type module -reference stream_to_ram stream_to_ram
set_property -dict {CONFIG.CHANNEL 1} [get_bd_cells stream_to_ram]
create_bd_cell -type module -reference fill_ram fill_ram
set_property -dict {CONFIG.CHANNEL 1 CONFIG.FILL_VALUE {"11111101"}} [get_bd_cells fill_ram]

# ---- hierarchy /channels/channel_1/ddr4_ram ----
current_bd_instance /channels/channel_1/ddr4_ram
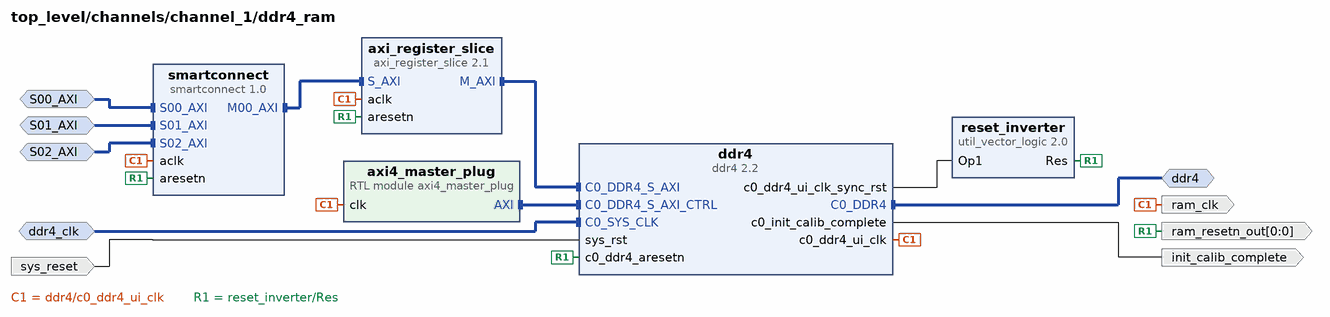
[diagram p17: block diagram inside /channels/channel_1/ddr4_ram]
create_bd_intf_pin -mode Slave -vlnv xilinx.com:interface:diff_clock_rtl:1.0 ddr4_clk
create_bd_intf_pin -mode Master -vlnv xilinx.com:interface:ddr4_rtl:1.0 ddr4
create_bd_intf_pin -mode Slave -vlnv xilinx.com:interface:aximm_rtl:1.0 S02_AXI
create_bd_intf_pin -mode Slave -vlnv xilinx.com:interface:aximm_rtl:1.0 S00_AXI
create_bd_intf_pin -mode Slave -vlnv xilinx.com:interface:aximm_rtl:1.0 S01_AXI
create_bd_pin -dir O -type clk ram_clk
create_bd_pin -dir I sys_reset
create_bd_pin -dir O init_calib_complete
create_bd_pin -dir O -from 0 -to 0 ram_resetn_out

create_bd_cell -type ip -vlnv xilinx.com:ip:ddr4:2.2 ddr4
set_property -dict [list \
  CONFIG.C0.DDR4_AxiAddressWidth 34 \
  CONFIG.C0.DDR4_AxiDataWidth 512 \
  CONFIG.C0.DDR4_CasWriteLatency 16 \
  CONFIG.C0.DDR4_CustomParts ../../../../../../ddr/MTA18ADF2G72PZ-2G3.csv \
  CONFIG.C0.DDR4_DataWidth 72 \
  CONFIG.C0.DDR4_EN_PARITY true \
  CONFIG.C0.DDR4_InputClockPeriod 9996 \
  CONFIG.C0.DDR4_MemoryPart MTA18ADF2G72PZ-2G3 \
  CONFIG.C0.DDR4_MemoryType RDIMMs \
  CONFIG.C0.DDR4_TimePeriod 833 \
  CONFIG.C0.DDR4_isCustom true \
] [get_bd_cells ddr4]
create_bd_cell -type ip -vlnv xilinx.com:ip:util_vector_logic:2.0 reset_inverter
set_property -dict {CONFIG.C_OPERATION not CONFIG.C_SIZE 1} [get_bd_cells reset_inverter]
create_bd_cell -type module -reference axi4_master_plug axi4_master_plug
create_bd_cell -type ip -vlnv xilinx.com:ip:smartconnect:1.0 smartconnect
set_property -dict {CONFIG.NUM_SI 3} [get_bd_cells smartconnect]
create_bd_cell -type ip -vlnv xilinx.com:ip:axi_register_slice:2.1 axi_register_slice
set_property -dict {CONFIG.REG_AR 1 CONFIG.REG_AW 1 CONFIG.REG_B 1} [get_bd_cells axi_register_slice]

# ---- hierarchy /channels/channel_2 ----
current_bd_instance /channels/channel_2
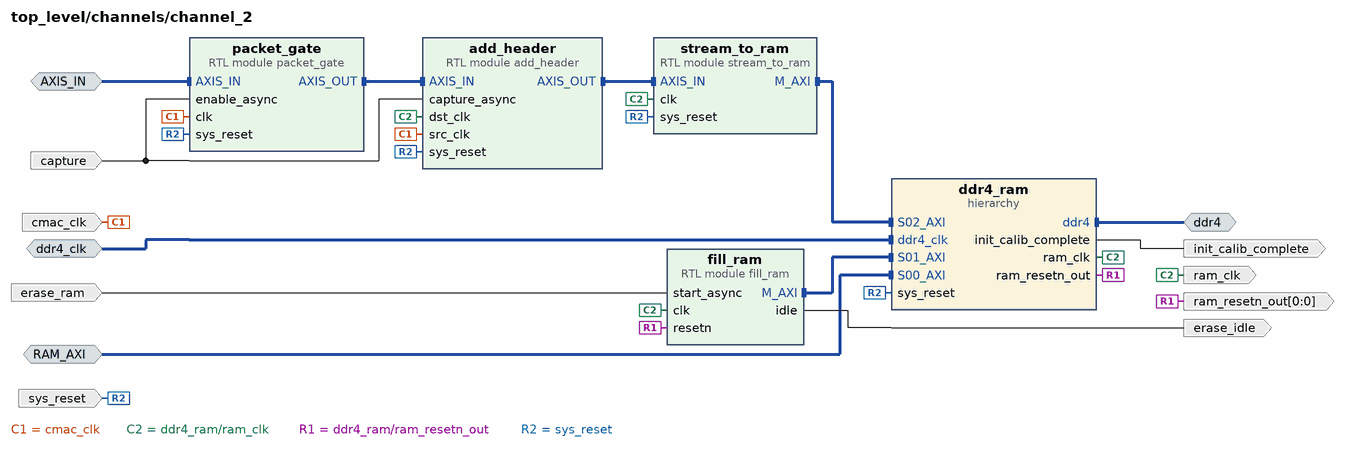
[diagram p18: block diagram inside /channels/channel_2]
create_bd_intf_pin -mode Slave -vlnv xilinx.com:interface:axis_rtl:1.0 AXIS_IN
create_bd_intf_pin -mode Master -vlnv xilinx.com:interface:ddr4_rtl:1.0 ddr4
create_bd_intf_pin -mode Slave -vlnv xilinx.com:interface:diff_clock_rtl:1.0 ddr4_clk
create_bd_intf_pin -mode Slave -vlnv xilinx.com:interface:aximm_rtl:1.0 RAM_AXI
create_bd_pin -dir I cmac_clk
create_bd_pin -dir I sys_reset
create_bd_pin -dir I capture
create_bd_pin -dir O erase_idle
create_bd_pin -dir I erase_ram
create_bd_pin -dir O init_calib_complete
create_bd_pin -dir O ram_clk
create_bd_pin -dir O -from 0 -to 0 ram_resetn_out

create_bd_cell -type module -reference packet_gate packet_gate
create_bd_cell -type hier ddr4_ram
create_bd_cell -type module -reference add_header add_header
set_property -dict {CONFIG.CHANNEL 2} [get_bd_cells add_header]
create_bd_cell -type module -reference stream_to_ram stream_to_ram
set_property -dict {CONFIG.CHANNEL 2} [get_bd_cells stream_to_ram]
create_bd_cell -type module -reference fill_ram fill_ram
set_property -dict {CONFIG.CHANNEL 2 CONFIG.FILL_VALUE {"11111101"}} [get_bd_cells fill_ram]

# ---- hierarchy /channels/channel_2/ddr4_ram ----
current_bd_instance /channels/channel_2/ddr4_ram
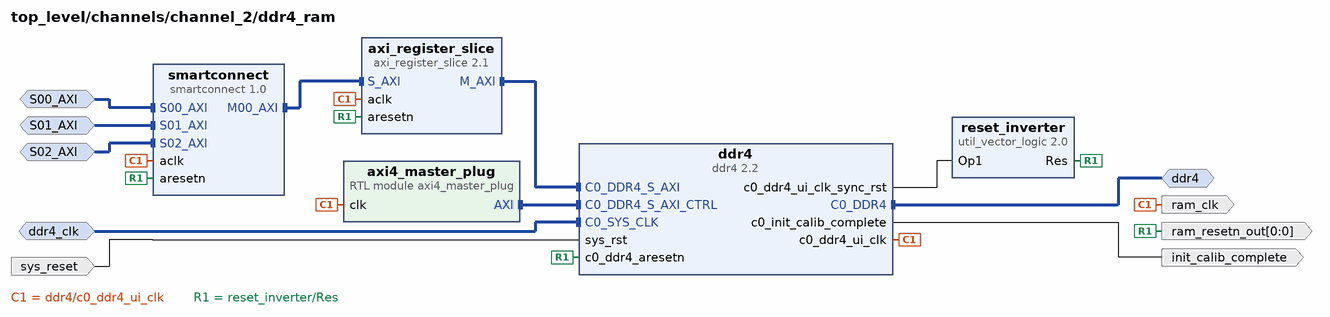
[diagram p19: block diagram inside /channels/channel_2/ddr4_ram]
create_bd_intf_pin -mode Slave -vlnv xilinx.com:interface:diff_clock_rtl:1.0 ddr4_clk
create_bd_intf_pin -mode Master -vlnv xilinx.com:interface:ddr4_rtl:1.0 ddr4
create_bd_intf_pin -mode Slave -vlnv xilinx.com:interface:aximm_rtl:1.0 S02_AXI
create_bd_intf_pin -mode Slave -vlnv xilinx.com:interface:aximm_rtl:1.0 S00_AXI
create_bd_intf_pin -mode Slave -vlnv xilinx.com:interface:aximm_rtl:1.0 S01_AXI
create_bd_pin -dir O -type clk ram_clk
create_bd_pin -dir I sys_reset
create_bd_pin -dir O init_calib_complete
create_bd_pin -dir O -from 0 -to 0 ram_resetn_out

create_bd_cell -type ip -vlnv xilinx.com:ip:ddr4:2.2 ddr4
set_property -dict [list \
  CONFIG.C0.DDR4_AxiAddressWidth 34 \
  CONFIG.C0.DDR4_AxiDataWidth 512 \
  CONFIG.C0.DDR4_CasWriteLatency 16 \
  CONFIG.C0.DDR4_CustomParts ../../../../../../ddr/MTA18ADF2G72PZ-2G3.csv \
  CONFIG.C0.DDR4_DataWidth 72 \
  CONFIG.C0.DDR4_EN_PARITY true \
  CONFIG.C0.DDR4_InputClockPeriod 9996 \
  CONFIG.C0.DDR4_MemoryPart MTA18ADF2G72PZ-2G3 \
  CONFIG.C0.DDR4_MemoryType RDIMMs \
  CONFIG.C0.DDR4_TimePeriod 833 \
  CONFIG.C0.DDR4_isCustom true \
] [get_bd_cells ddr4]
create_bd_cell -type ip -vlnv xilinx.com:ip:util_vector_logic:2.0 reset_inverter
set_property -dict {CONFIG.C_OPERATION not CONFIG.C_SIZE 1} [get_bd_cells reset_inverter]
create_bd_cell -type module -reference axi4_master_plug axi4_master_plug
create_bd_cell -type ip -vlnv xilinx.com:ip:smartconnect:1.0 smartconnect
set_property -dict {CONFIG.NUM_SI 3} [get_bd_cells smartconnect]
create_bd_cell -type ip -vlnv xilinx.com:ip:axi_register_slice:2.1 axi_register_slice
set_property -dict {CONFIG.REG_AR 1 CONFIG.REG_AW 1 CONFIG.REG_B 1} [get_bd_cells axi_register_slice]

# ---- hierarchy /channels/channel_3 ----
current_bd_instance /channels/channel_3
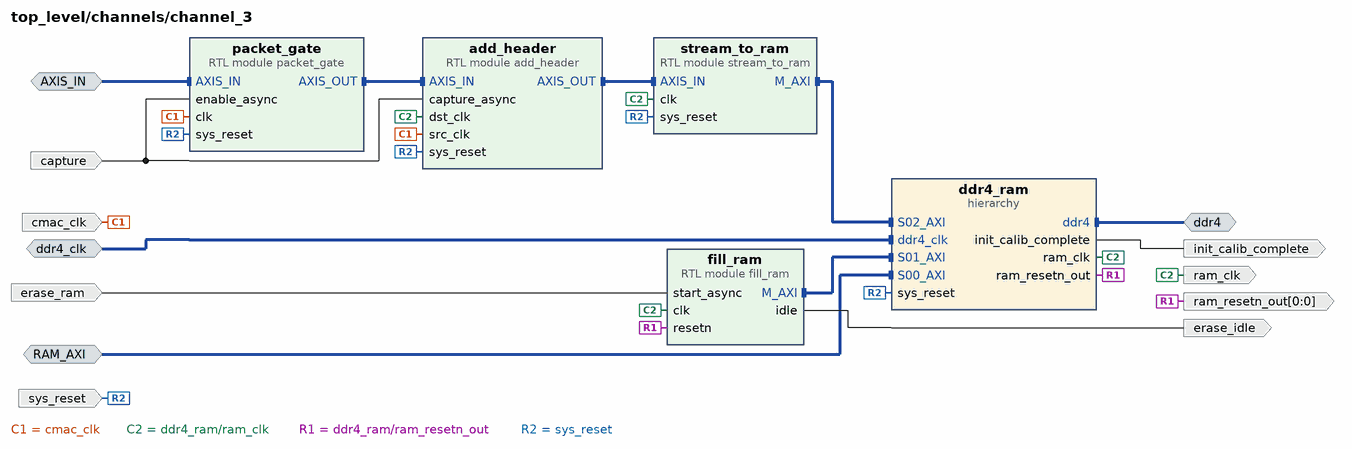
[diagram p20: block diagram inside /channels/channel_3]
create_bd_intf_pin -mode Slave -vlnv xilinx.com:interface:axis_rtl:1.0 AXIS_IN
create_bd_intf_pin -mode Master -vlnv xilinx.com:interface:ddr4_rtl:1.0 ddr4
create_bd_intf_pin -mode Slave -vlnv xilinx.com:interface:diff_clock_rtl:1.0 ddr4_clk
create_bd_intf_pin -mode Slave -vlnv xilinx.com:interface:aximm_rtl:1.0 RAM_AXI
create_bd_pin -dir I cmac_clk
create_bd_pin -dir I sys_reset
create_bd_pin -dir I capture
create_bd_pin -dir O erase_idle
create_bd_pin -dir I erase_ram
create_bd_pin -dir O init_calib_complete
create_bd_pin -dir O ram_clk
create_bd_pin -dir O -from 0 -to 0 ram_resetn_out

create_bd_cell -type module -reference packet_gate packet_gate
create_bd_cell -type hier ddr4_ram
create_bd_cell -type module -reference add_header add_header
set_property -dict {CONFIG.CHANNEL 3} [get_bd_cells add_header]
create_bd_cell -type module -reference stream_to_ram stream_to_ram
set_property -dict {CONFIG.CHANNEL 3} [get_bd_cells stream_to_ram]
create_bd_cell -type module -reference fill_ram fill_ram
set_property -dict {CONFIG.CHANNEL 3 CONFIG.FILL_VALUE {"11111101"}} [get_bd_cells fill_ram]

# ---- hierarchy /channels/channel_3/ddr4_ram ----
current_bd_instance /channels/channel_3/ddr4_ram
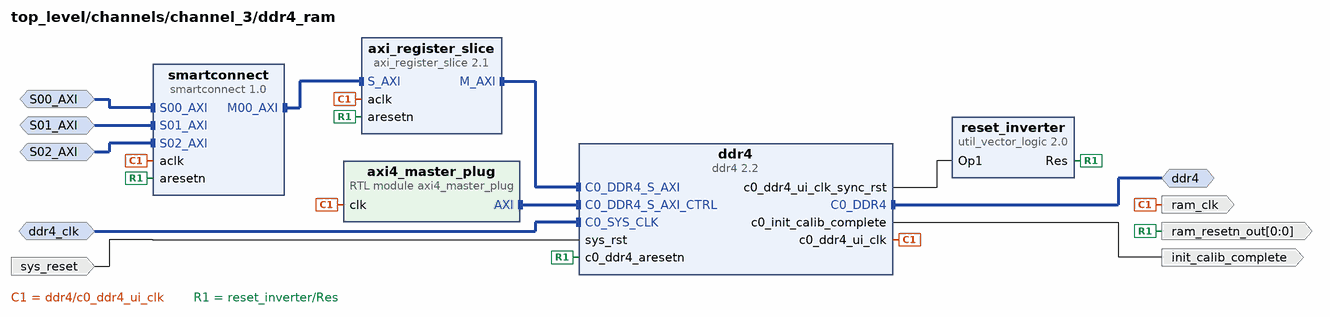
[diagram p21: block diagram inside /channels/channel_3/ddr4_ram]
create_bd_intf_pin -mode Slave -vlnv xilinx.com:interface:diff_clock_rtl:1.0 ddr4_clk
create_bd_intf_pin -mode Master -vlnv xilinx.com:interface:ddr4_rtl:1.0 ddr4
create_bd_intf_pin -mode Slave -vlnv xilinx.com:interface:aximm_rtl:1.0 S00_AXI
create_bd_intf_pin -mode Slave -vlnv xilinx.com:interface:aximm_rtl:1.0 S01_AXI
create_bd_intf_pin -mode Slave -vlnv xilinx.com:interface:aximm_rtl:1.0 S02_AXI
create_bd_pin -dir O -type clk ram_clk
create_bd_pin -dir I sys_reset
create_bd_pin -dir O init_calib_complete
create_bd_pin -dir O -from 0 -to 0 ram_resetn_out

create_bd_cell -type ip -vlnv xilinx.com:ip:ddr4:2.2 ddr4
set_property -dict [list \
  CONFIG.C0.DDR4_AxiAddressWidth 34 \
  CONFIG.C0.DDR4_AxiDataWidth 512 \
  CONFIG.C0.DDR4_CasWriteLatency 16 \
  CONFIG.C0.DDR4_CustomParts ../../../../../../ddr/MTA18ADF2G72PZ-2G3.csv \
  CONFIG.C0.DDR4_DataWidth 72 \
  CONFIG.C0.DDR4_EN_PARITY true \
  CONFIG.C0.DDR4_InputClockPeriod 9996 \
  CONFIG.C0.DDR4_MemoryPart MTA18ADF2G72PZ-2G3 \
  CONFIG.C0.DDR4_MemoryType RDIMMs \
  CONFIG.C0.DDR4_TimePeriod 833 \
  CONFIG.C0.DDR4_isCustom true \
] [get_bd_cells ddr4]
create_bd_cell -type ip -vlnv xilinx.com:ip:util_vector_logic:2.0 reset_inverter
set_property -dict {CONFIG.C_OPERATION not CONFIG.C_SIZE 1} [get_bd_cells reset_inverter]
create_bd_cell -type module -reference axi4_master_plug axi4_master_plug
create_bd_cell -type ip -vlnv xilinx.com:ip:smartconnect:1.0 smartconnect
set_property -dict {CONFIG.NUM_SI 3} [get_bd_cells smartconnect]
create_bd_cell -type ip -vlnv xilinx.com:ip:axi_register_slice:2.1 axi_register_slice
set_property -dict {CONFIG.REG_AR 1 CONFIG.REG_AW 1 CONFIG.REG_B 1} [get_bd_cells axi_register_slice]

# ---- hierarchy /dma_data_mover ----
current_bd_instance /dma_data_mover
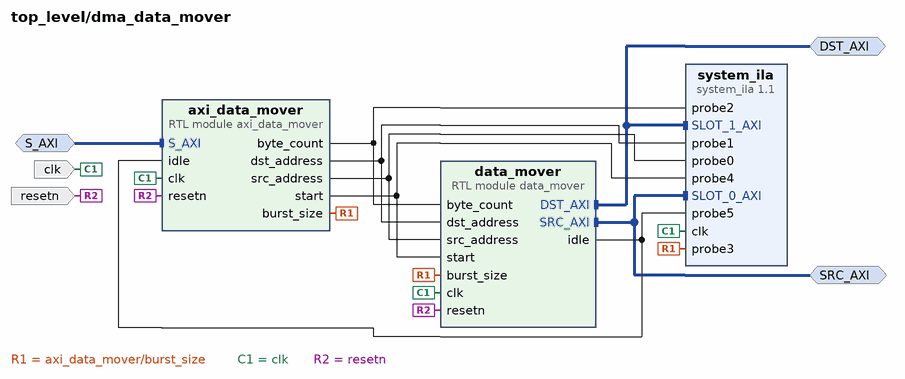
[diagram p22: block diagram inside /dma_data_mover]
create_bd_intf_pin -mode Master -vlnv xilinx.com:interface:aximm_rtl:1.0 DST_AXI
create_bd_intf_pin -mode Master -vlnv xilinx.com:interface:aximm_rtl:1.0 SRC_AXI
create_bd_intf_pin -mode Slave -vlnv xilinx.com:interface:aximm_rtl:1.0 S_AXI
create_bd_pin -dir I -type clk clk
create_bd_pin -dir I -type rst resetn

create_bd_cell -type module -reference data_mover data_mover
create_bd_cell -type ip -vlnv xilinx.com:ip:system_ila:1.1 system_ila
set_property -dict {CONFIG.C_MON_TYPE MIX CONFIG.C_NUM_MONITOR_SLOTS 2 CONFIG.C_NUM_OF_PROBES 6} [get_bd_cells system_ila]
create_bd_cell -type module -reference axi_data_mover axi_data_mover

# ---- connections ----

current_bd_instance /crossover
connect_bd_intf_net [get_bd_intf_pins S_AXI_PC1] [get_bd_intf_pins eth1/S_AXI_PC]
connect_bd_intf_net [get_bd_intf_pins S_AXI_PC0] [get_bd_intf_pins eth0/S_AXI_PC]
connect_bd_intf_net [get_bd_intf_pins S_AXI_PC2] [get_bd_intf_pins eth2/S_AXI_PC]
connect_bd_intf_net [get_bd_intf_pins S_AXI_PC3] [get_bd_intf_pins eth3/S_AXI_PC]
connect_bd_intf_net [get_bd_intf_pins crossover_0x2/axis_rx_a] [get_bd_intf_pins eth0/axis_rx]
connect_bd_intf_net [get_bd_intf_pins crossover_0x2/axis_rx_b] [get_bd_intf_pins eth2/axis_rx]
connect_bd_intf_net [get_bd_intf_pins eth1/axis_tx] [get_bd_intf_pins crossover_1x3/axis_tx_a]
connect_bd_intf_net [get_bd_intf_pins eth3/axis_tx] [get_bd_intf_pins crossover_1x3/axis_tx_b]
connect_bd_intf_net [get_bd_intf_pins crossover_0x2/axis_tx_a] [get_bd_intf_pins eth0/axis_tx]
connect_bd_intf_net [get_bd_intf_pins crossover_0x2/axis_tx_b] [get_bd_intf_pins eth2/axis_tx]
connect_bd_intf_net [get_bd_intf_pins rx0_out] [get_bd_intf_pins crossover_0x2/rx_out_a]
connect_bd_intf_net [get_bd_intf_pins rx2_out] [get_bd_intf_pins crossover_0x2/rx_out_b]
connect_bd_intf_net [get_bd_intf_pins rx1_out] [get_bd_intf_pins crossover_1x3/rx_out_a]
connect_bd_intf_net [get_bd_intf_pins rx3_out] [get_bd_intf_pins crossover_1x3/rx_out_b]
connect_bd_intf_net [get_bd_intf_pins eth1/axis_rx] [get_bd_intf_pins crossover_1x3/axis_rx_a]
connect_bd_intf_net [get_bd_intf_pins eth3/axis_rx] [get_bd_intf_pins crossover_1x3/axis_rx_b]
connect_bd_intf_net [get_bd_intf_pins qsfp0_gt] [get_bd_intf_pins eth0/qsfp_gt]
connect_bd_intf_net [get_bd_intf_pins qsfp2_gt] [get_bd_intf_pins eth2/qsfp_gt]
connect_bd_intf_net [get_bd_intf_pins qsfp1_gt] [get_bd_intf_pins eth1/qsfp_gt]
connect_bd_intf_net [get_bd_intf_pins qsfp3_gt] [get_bd_intf_pins eth3/qsfp_gt]
connect_bd_intf_net [get_bd_intf_pins qsfp0_clk] [get_bd_intf_pins eth0/qsfp_clk]
connect_bd_intf_net [get_bd_intf_pins qsfp1_clk] [get_bd_intf_pins eth1/qsfp_clk]
connect_bd_intf_net [get_bd_intf_pins qsfp2_clk] [get_bd_intf_pins eth2/qsfp_clk]
connect_bd_intf_net [get_bd_intf_pins qsfp3_clk] [get_bd_intf_pins eth3/qsfp_clk]
connect_bd_net -net clk_a_1 [get_bd_pins eth0/stream_clk] [get_bd_pins crossover_0x2/clk_a] [get_bd_pins cmac0_clk]
connect_bd_net -net clk_b_1 [get_bd_pins eth2/stream_clk] [get_bd_pins crossover_0x2/clk_b] [get_bd_pins cmac2_clk]
connect_bd_net -net crossover_0x2_active_a [get_bd_pins crossover_0x2/overflow_a] [get_bd_pins overflow_0]
connect_bd_net -net crossover_0x2_active_b [get_bd_pins crossover_0x2/overflow_b] [get_bd_pins overflow_2]
connect_bd_net -net crossover_1x3_active_a [get_bd_pins crossover_1x3/overflow_a] [get_bd_pins overflow_1]
connect_bd_net [get_bd_pins crossover_1x3/overflow_b] [get_bd_pins overflow_3]
connect_bd_net [get_bd_pins eth0/aligned] [get_bd_pins eth0_up]
connect_bd_net [get_bd_pins eth1/aligned] [get_bd_pins eth1_up]
connect_bd_net [get_bd_pins eth1/stream_clk] [get_bd_pins crossover_1x3/clk_a] [get_bd_pins cmac1_clk]
connect_bd_net [get_bd_pins eth1/stream_resetn] [get_bd_pins crossover_1x3/resetn_a]
connect_bd_net [get_bd_pins eth2/aligned] [get_bd_pins eth2_up]
connect_bd_net [get_bd_pins eth3/aligned] [get_bd_pins eth3_up]
connect_bd_net [get_bd_pins eth3/stream_clk] [get_bd_pins crossover_1x3/clk_b] [get_bd_pins cmac3_clk]
connect_bd_net [get_bd_pins eth3/stream_resetn] [get_bd_pins crossover_1x3/resetn_b]
connect_bd_net -net init_clk_0_1 [get_bd_pins init_clk] \
  [get_bd_pins eth0/init_clk] [get_bd_pins eth2/init_clk] [get_bd_pins eth1/init_clk] [get_bd_pins eth3/init_clk]
connect_bd_net -net resetn_a_1 [get_bd_pins eth0/stream_resetn] [get_bd_pins crossover_0x2/resetn_a]
connect_bd_net -net resetn_b_1 [get_bd_pins eth2/stream_resetn] [get_bd_pins crossover_0x2/resetn_b]
connect_bd_net -net source_200Mhz_resetn [get_bd_pins sys_resetn] \
  [get_bd_pins eth0/sys_resetn] [get_bd_pins eth2/sys_resetn] [get_bd_pins eth1/sys_resetn] [get_bd_pins eth3/sys_resetn]
connect_bd_net [get_bd_pins sys_clk] [get_bd_pins eth0/sys_clk] [get_bd_pins eth2/sys_clk] [get_bd_pins eth1/sys_clk] [get_bd_pins eth3/sys_clk]

current_bd_instance /crossover/crossover_0x2
connect_bd_intf_net [get_bd_intf_pins axis_tx_b] [get_bd_intf_pins axis_packetizer_a2b/m_axis]
connect_bd_intf_net [get_bd_intf_pins axis_tx_a] [get_bd_intf_pins axis_packetizer_b2a/m_axis]
connect_bd_intf_net [get_bd_intf_pins axis_tee_a/axis_out0] [get_bd_intf_pins axis_packetizer_a2b/s_axis]
connect_bd_intf_net [get_bd_intf_pins axis_tee_a/axis_out0] [get_bd_intf_pins fifo_monitor_a/stream]
connect_bd_intf_net [get_bd_intf_pins axis_rx_a] [get_bd_intf_pins axis_tee_a/axis_in]
connect_bd_intf_net [get_bd_intf_pins axis_tee_b/axis_out0] [get_bd_intf_pins axis_packetizer_b2a/s_axis]
connect_bd_intf_net [get_bd_intf_pins axis_tee_b/axis_out0] [get_bd_intf_pins fifo_monitor_b/stream]
connect_bd_intf_net [get_bd_intf_pins axis_rx_b] [get_bd_intf_pins axis_tee_b/axis_in]
connect_bd_intf_net [get_bd_intf_pins rx_out_a] [get_bd_intf_pins axis_tee_a/axis_out1]
connect_bd_intf_net [get_bd_intf_pins rx_out_b] [get_bd_intf_pins axis_tee_b/axis_out1]
connect_bd_net [get_bd_pins clk_a] \
  [get_bd_pins axis_tee_a/clk] [get_bd_pins fifo_monitor_a/clk] [get_bd_pins axis_packetizer_a2b/s_axis_aclk] \
  [get_bd_pins axis_packetizer_b2a/m_axis_aclk]
connect_bd_net [get_bd_pins clk_b] \
  [get_bd_pins axis_tee_b/clk] [get_bd_pins fifo_monitor_b/clk] [get_bd_pins axis_packetizer_a2b/m_axis_aclk] \
  [get_bd_pins axis_packetizer_b2a/s_axis_aclk]
connect_bd_net [get_bd_pins fifo_monitor_a/overflow] [get_bd_pins overflow_a]
connect_bd_net [get_bd_pins fifo_monitor_b/overflow] [get_bd_pins overflow_b]
connect_bd_net [get_bd_pins resetn_a] \
  [get_bd_pins axis_tee_a/resetn] [get_bd_pins fifo_monitor_a/resetn] [get_bd_pins axis_packetizer_a2b/s_axis_aresetn] \
  [get_bd_pins axis_packetizer_b2a/m_axis_aresetn]
connect_bd_net [get_bd_pins resetn_b] \
  [get_bd_pins axis_tee_b/resetn] [get_bd_pins fifo_monitor_b/resetn] [get_bd_pins axis_packetizer_a2b/m_axis_aresetn] \
  [get_bd_pins axis_packetizer_b2a/s_axis_aresetn]

current_bd_instance /crossover/eth0
connect_bd_intf_net [get_bd_intf_pins axis_tx] [get_bd_intf_pins cmac/axis_tx]
connect_bd_intf_net [get_bd_intf_pins axis_tx] [get_bd_intf_pins packet_counters/tx_monitor]
connect_bd_intf_net [get_bd_intf_pins S_AXI_PC] [get_bd_intf_pins packet_counters/S_AXI]
connect_bd_intf_net [get_bd_intf_pins axis_rx] [get_bd_intf_pins cmac/axis_rx]
connect_bd_intf_net [get_bd_intf_pins axis_rx] [get_bd_intf_pins packet_counters/rx_monitor]
connect_bd_intf_net [get_bd_intf_pins cmac_control/ctl_rx] [get_bd_intf_pins cmac/ctl_rx]
connect_bd_intf_net [get_bd_intf_pins cmac_control/ctl_tx] [get_bd_intf_pins cmac/ctl_tx]
connect_bd_intf_net [get_bd_intf_pins cmac_control/gt_trans_debug] [get_bd_intf_pins cmac/gt_trans_debug]
connect_bd_intf_net [get_bd_intf_pins cmac_control/rs_fec] [get_bd_intf_pins cmac/rs_fec_in]
connect_bd_intf_net [get_bd_intf_pins cmac_control/stat_rx] [get_bd_intf_pins cmac/stat_rx]
connect_bd_intf_net [get_bd_intf_pins qsfp_gt] [get_bd_intf_pins cmac/gt_serial_port]
connect_bd_intf_net [get_bd_intf_pins qsfp_clk] [get_bd_intf_pins cmac/gt_ref_clk]
connect_bd_net -net clk_0_1 [get_bd_pins init_clk] [get_bd_pins cmac/gt_drpclk] [get_bd_pins cmac/init_clk] [get_bd_pins cmac/drp_clk]
connect_bd_net -net cmac_control_0_reset_rx_datapath [get_bd_pins cmac_control/reset_rx_datapath] [get_bd_pins cmac/gtwiz_reset_rx_datapath]
connect_bd_net -net cmac_control_0_rx_resetn_out [get_bd_pins cmac_control/rx_resetn_out] \
  [get_bd_pins stream_resetn] [get_bd_pins packet_counters/stream_resetn]
connect_bd_net -net cmac_control_0_sync_rx_aligned [get_bd_pins cmac_control/sync_rx_aligned] [get_bd_pins aligned]
connect_bd_net [get_bd_pins cmac_control/sys_reset_out] [get_bd_pins cmac/sys_reset]
connect_bd_net -net cmac_gt_rxusrclk2 [get_bd_pins cmac/gt_txusrclk2] \
  [get_bd_pins stream_clk] [get_bd_pins cmac/rx_clk] [get_bd_pins cmac_control/rx_clk] \
  [get_bd_pins packet_counters/stream_clk]
connect_bd_net [get_bd_pins sys_clk] [get_bd_pins packet_counters/sys_clk]
connect_bd_net [get_bd_pins sys_resetn] [get_bd_pins cmac_control/sys_resetn_in]

current_bd_instance /crossover/eth0/packet_counters
connect_bd_intf_net [get_bd_intf_pins rx_monitor] [get_bd_intf_pins ds_rxpkt_counter/monitor]
connect_bd_intf_net [get_bd_intf_pins tx_monitor] [get_bd_intf_pins ds_txpkt_counter/monitor]
connect_bd_intf_net [get_bd_intf_pins S_AXI] [get_bd_intf_pins axi_clock_converter/S_AXI]
connect_bd_intf_net [get_bd_intf_pins axi_clock_converter/M_AXI] [get_bd_intf_pins pkt_counter_ctl/S_AXI]
connect_bd_net -net cmac_control_0_rx_resetn_out [get_bd_pins stream_resetn] \
  [get_bd_pins axi_clock_converter/m_axi_aresetn] [get_bd_pins pkt_counter_ctl/resetn] [get_bd_pins ds_rxpkt_counter/aresetn] \
  [get_bd_pins ds_txpkt_counter/aresetn]
connect_bd_net -net cmac_gt_rxusrclk2 [get_bd_pins stream_clk] \
  [get_bd_pins axi_clock_converter/m_axi_aclk] [get_bd_pins pkt_counter_ctl/clk] [get_bd_pins ds_rxpkt_counter/clk] \
  [get_bd_pins ds_txpkt_counter/clk]
connect_bd_net [get_bd_pins ds_rxpkt_counter/bad_packets] [get_bd_pins pkt_counter_ctl/bad_packets]
connect_bd_net [get_bd_pins ds_rxpkt_counter/fc_packets] [get_bd_pins pkt_counter_ctl/fc_packets]
connect_bd_net [get_bd_pins ds_rxpkt_counter/fd_packets] [get_bd_pins pkt_counter_ctl/fd_packets]
connect_bd_net [get_bd_pins ds_rxpkt_counter/md_packets] [get_bd_pins pkt_counter_ctl/md_packets]
connect_bd_net [get_bd_pins ds_rxpkt_counter/other_packets] [get_bd_pins pkt_counter_ctl/other_packets_in]
connect_bd_net [get_bd_pins ds_txpkt_counter/len4160_packets] [get_bd_pins pkt_counter_ctl/abm_packets]
connect_bd_net [get_bd_pins ds_txpkt_counter/other_packets] [get_bd_pins pkt_counter_ctl/other_packets_out]
connect_bd_net [get_bd_pins sys_clk] [get_bd_pins axi_clock_converter/s_axi_aclk]
connect_bd_net -net xlconstant_0_dout [get_bd_pins one/dout] [get_bd_pins axi_clock_converter/s_axi_aresetn]
